# Altium schematic sheet PAGE110.SchDoc
size 246 x 182 mm
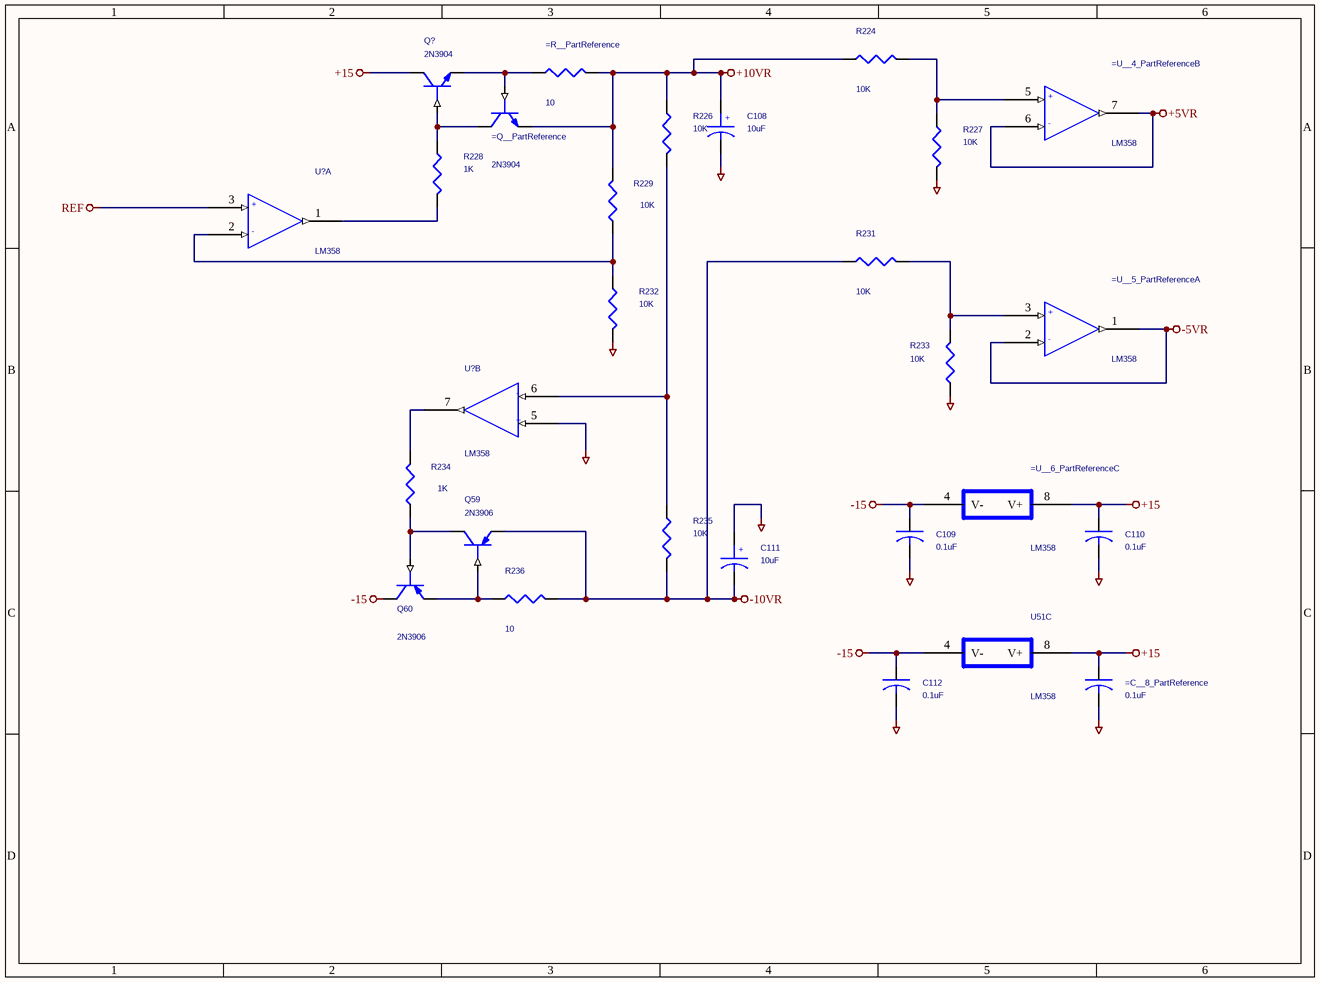
[diagram p0: PAGE110.SchDoc]

## Parts
(Parts that share a designator on the sheet are numbered #1, #2 ... from top to bottom, then left to right.)
=C__8_PartReference  0.1uF  [AXIALCAP0.3]
=Q__PartReference  2N3904  [TO92]
=R__PartReference  10  [AXIAL0.4]
=U__4_PartReference  LM358  [DIP8]  (part B of 3)
=U__5_PartReference  LM358  [DIP8]  (part A of 3)
=U__6_PartReference  LM358  [DIP8]  (part C of 3)
C108  10uF  [RB5/2]
C109  0.1uF  [AXIALCAP0.3]
C110  0.1uF  [AXIALCAP0.3]
C111  10uF  [RB5/2]
C112  0.1uF  [AXIALCAP0.3]
Q59  2N3906  [TO92]
Q60  2N3906  [TO92]
Q?  2N3904  [TO92]
R224  10K  [AXIAL0.4]
R226  10K  [AXIAL0.4]
R227  10K  [AXIAL0.4]
R228  1K  [AXIAL0.4]
R229  10K  [AXIAL0.4]
R231  10K  [AXIAL0.4]
R232  10K  [AXIAL0.4]
R233  10K  [AXIAL0.4]
R234  1K  [AXIAL0.4]
R235  10K  [AXIAL0.4]
R236  10  [AXIAL0.4]
U51  LM358  [DIP8]  (part C of 3)
U?#1  LM358  [DIP8]  (part A of 3)
U?#2  LM358  [DIP8]  (part B of 3)

## Nets
+5VR: =U__4_PartReference.6(-) =U__4_PartReference.7(OUT)
+10VR: =Q__PartReference.EMITTER =R__PartReference.2 C108.1 R224.1 R226.1 R229.2
+15: =C__8_PartReference.1 =U__6_PartReference.8(V+) C110.1 Q?.COLLECTOR U51.8(V+)
-5VR: =U__5_PartReference.1(OUT) =U__5_PartReference.2(-)
-10VR: C111.2 Q59.EMITTER R231.1 R235.2 R236.2
-15: =U__6_PartReference.4(V-) C109.1 C112.1 Q60.COLLECTOR U51.4(V-)
AGND: =C__8_PartReference.2 C108.2 C109.2 C110.2 C111.1 C112.2 R227.2 R232.2 R233.1 U?#2.5(+)
REF: U?#1.3(+)
Net=Q__PartReference_BASE: =Q__PartReference.BASE =R__PartReference.1 Q?.EMITTER
Net=Q__PartReference_COLLECTOR: =Q__PartReference.COLLECTOR Q?.BASE R228.1
Net=U__4_PartReference_5: =U__4_PartReference.5(+) R224.2 R227.1
Net=U__5_PartReference_3: =U__5_PartReference.3(+) R231.2 R233.2
NetQ59_BASE: Q59.BASE Q60.EMITTER R236.1
NetQ59_COLLECTOR: Q59.COLLECTOR Q60.BASE R234.1
NetR226_2: R226.2 R235.1 U?#2.6(-)
NetR228_2: R228.2 U?#1.1(OUT)
NetR229_1: R229.1 R232.1 U?#1.2(-)
NetR234_2: R234.2 U?#2.7(OUT)

## Notes on the sheet
- (in symbol CAPACITOR POL) +

## Library data of the parts
=C__8_PartReference C109 C110 C112 = CAP_Dup1
=Q__PartReference Q? = NPN
=R__PartReference R224 R226-R229 R231-R236 = R_Dup1
  =R__PartReference: M26_PartReference: =R__M26_PartReference; M26_PACKAGE: =R__M26_PACKAGE; U__7_PartReference: =R__U__7_PartReference; U__7_PACKAGE: =R__U__7_PACKAGE; M27_PartReference: =R__M27_PartReference; M27_PACKAGE: =R__M27_PACKAGE; U__2_PartReference: =R__U__2_PartReference; U__2_PACKAGE: =R__U__2_PACKAGE; U__PartReference: =R__U__PartReference; U__PACKAGE: =R__U__PACKAGE; C__4_PartReference: =R__C__4_PartReference; U__3_PartReference: =R__U__3_PartReference; U__3_PACKAGE: =R__U__3_PACKAGE; Q__PartReference: =R__Q__PartReference; C__6_PartReference: =R__C__6_PartReference; C__7_PartReference: =R__C__7_PartReference; Q__1_PartReference: =R__Q__1_PartReference; C__5_PartReference: =R__C__5_PartReference; Q__2_PartReference: =R__Q__2_PartReference; Q__3_PartReference: =R__Q__3_PartReference; R__14_PartReference: =R__R__14_PartReference; R__15_PartReference: =R__R__15_PartReference; TitleBlock_Page_Number: =R__TitleBlock_Page_Number; TitleBlock_Title: =R__TitleBlock_Title
=U__4_PartReference =U__5_PartReference =U__6_PartReference U51 U?#1 U?#2 = GEN DUAL OPAMP-H
  =U__4_PartReference =U__6_PartReference U?#1: PACKAGE: REF_1
  =U__5_PartReference U51 U?#2: PACKAGE: REF_2
C108 C111 = CAPACITOR POL
Q59 Q60 = PNP